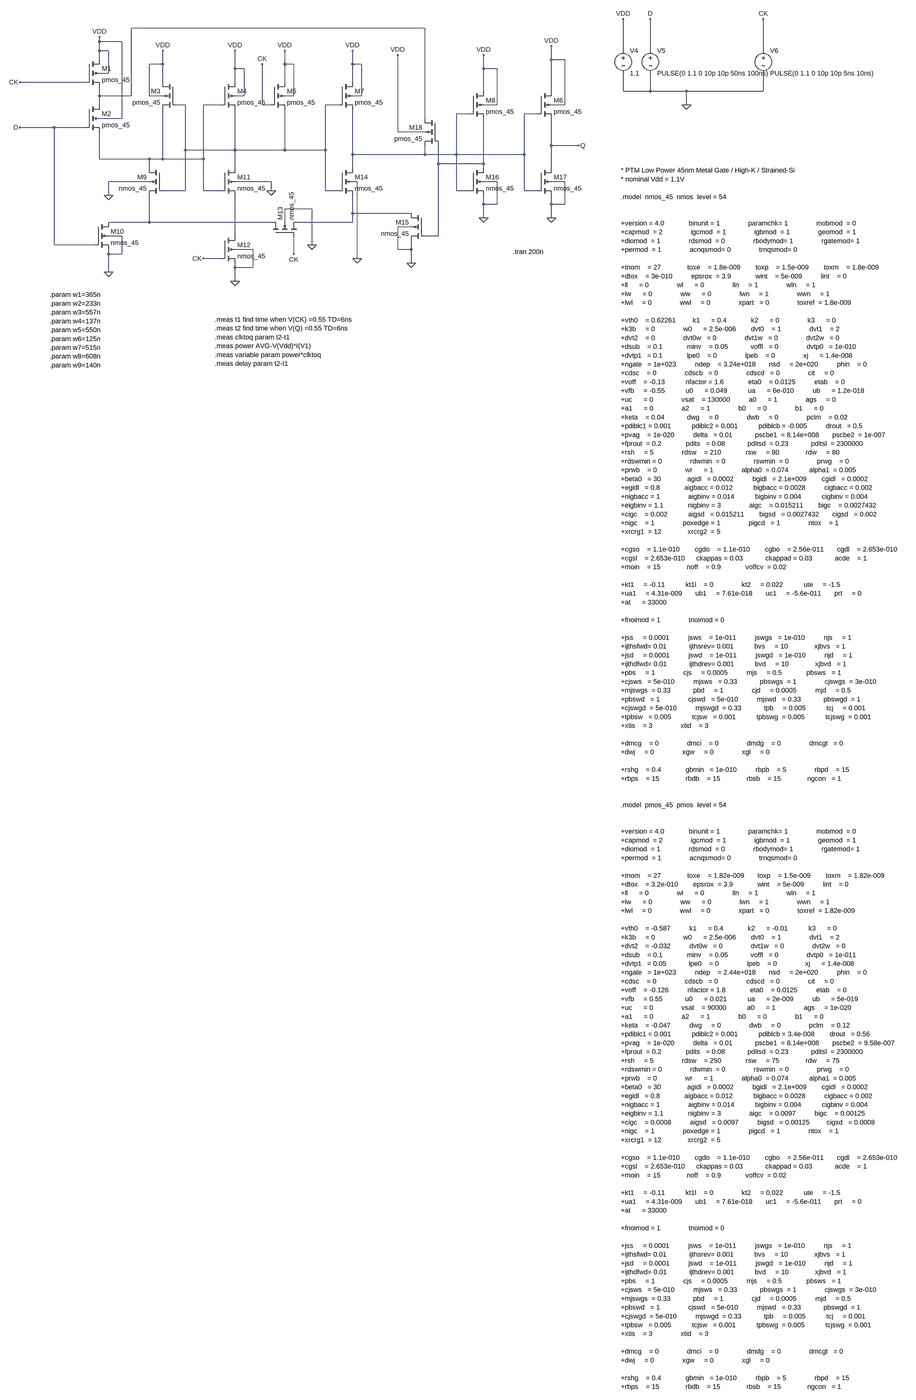
[diagram p0: schematic SPC-18T.asc, whole sheet]
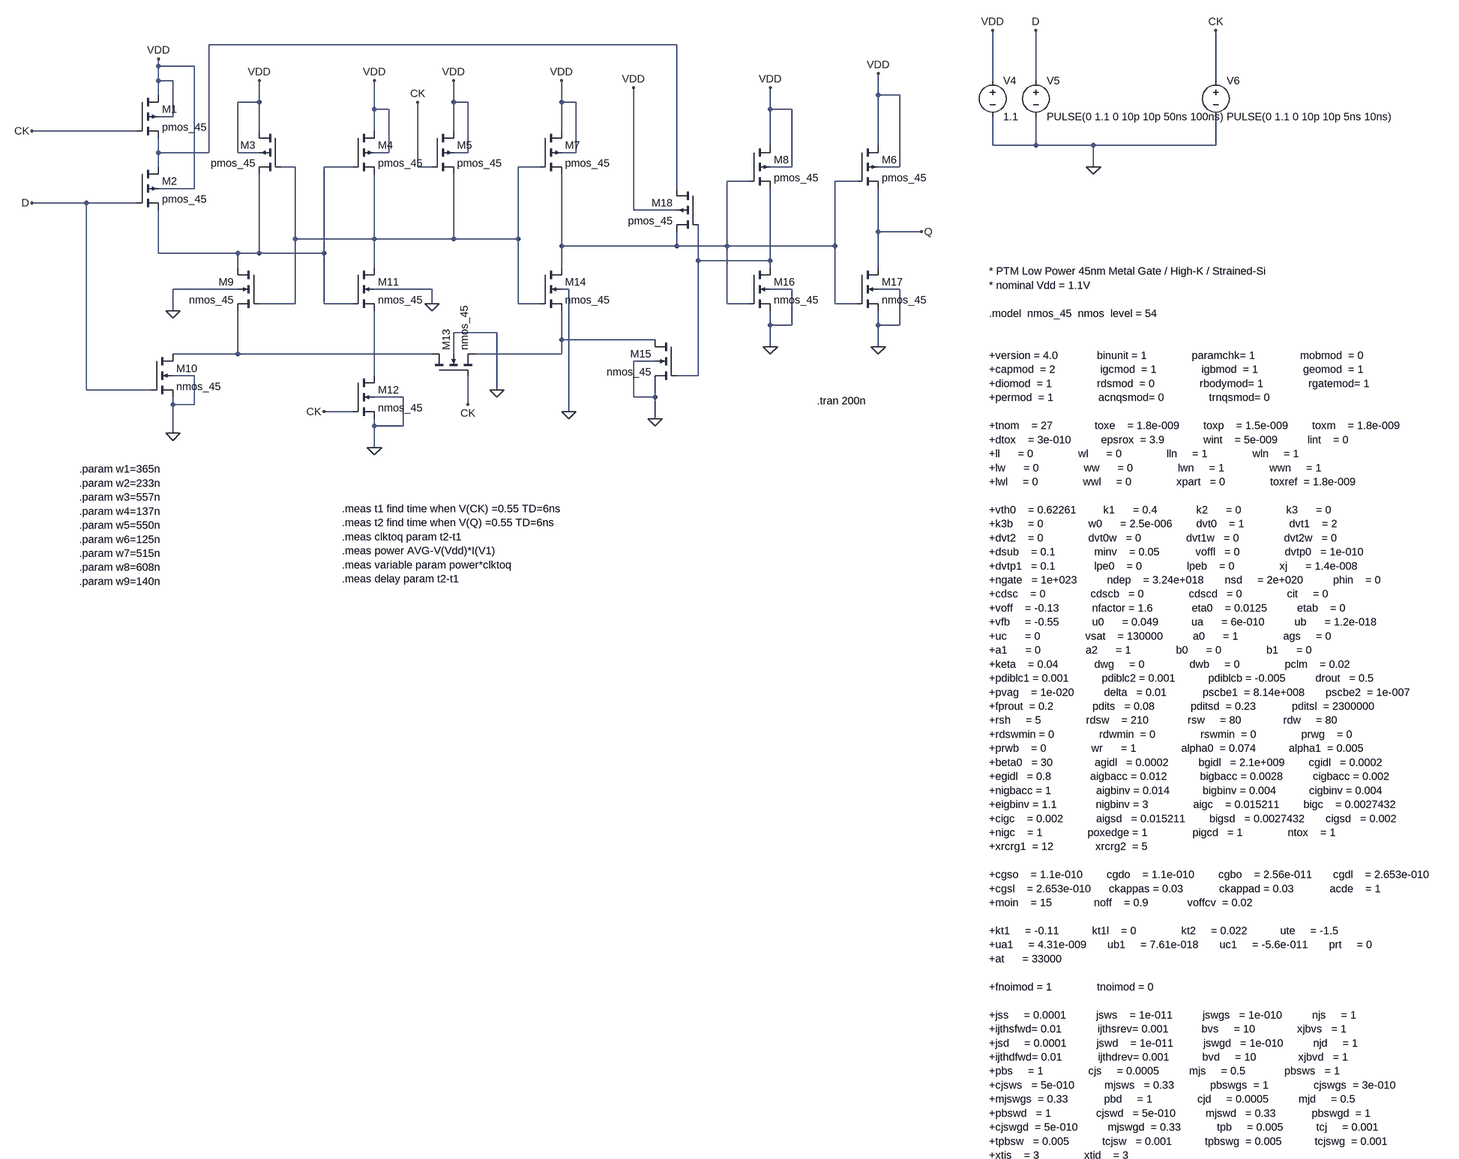
[diagram p1: schematic SPC-18T.asc, part, row 1 of 2, column 1 of 1]
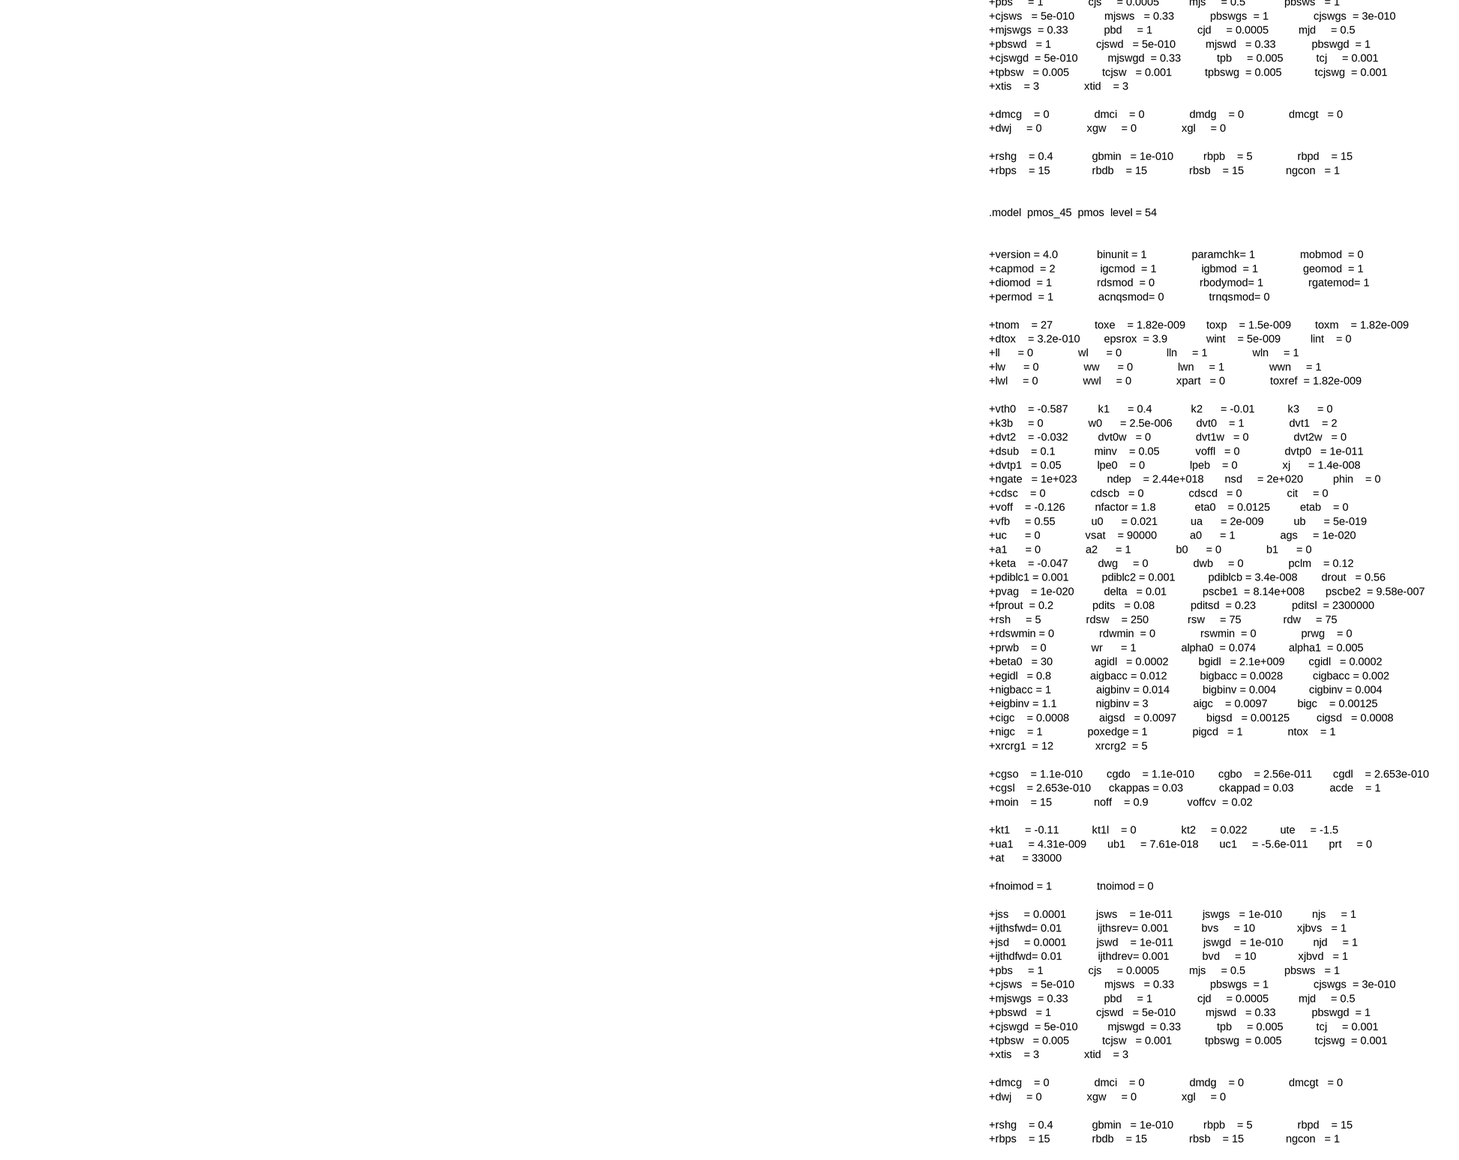
[diagram p2: schematic SPC-18T.asc, part, row 2 of 2, column 1 of 1]
SPC-18T.asc, the LTspice schematic file:
Version 4
SHEET 1 3776 4260
WIRE 912 -144 -128 -144
WIRE -240 -96 -240 -112
WIRE -160 -96 -240 -96
WIRE -240 -64 -240 -96
WIRE -208 -64 -240 -64
WIRE 1696 -64 1696 -176
WIRE 1792 -64 1792 -176
WIRE 2192 -64 2192 -176
WIRE -240 -32 -240 -64
WIRE 1360 -32 1360 -80
WIRE 1408 -32 1360 -32
WIRE -16 -16 -16 -64
WIRE -16 -16 -64 -16
WIRE 416 -16 416 -64
WIRE 448 -16 416 -16
WIRE 656 -16 656 -64
WIRE 688 -16 656 -16
WIRE 240 0 240 -64
WIRE 272 0 240 0
WIRE 1120 0 1120 -48
WIRE 1168 0 1120 0
WIRE -208 16 -208 -64
WIRE -208 16 -240 16
WIRE -288 48 -528 48
WIRE -16 48 -16 -16
WIRE 240 48 240 0
WIRE 416 48 416 -16
WIRE 656 48 656 -16
WIRE 1120 80 1120 0
WIRE 1360 80 1360 -32
WIRE 1696 80 1696 16
WIRE 1792 80 1792 16
WIRE 1792 80 1696 80
WIRE 1920 80 1792 80
WIRE 2192 80 2192 16
WIRE 2192 80 1920 80
WIRE -240 96 -240 64
WIRE -128 96 -128 -144
WIRE -128 96 -240 96
WIRE -64 96 -64 -16
WIRE -16 96 -64 96
WIRE 272 96 272 0
WIRE 272 96 240 96
WIRE 448 96 448 -16
WIRE 448 96 416 96
WIRE 688 96 688 -16
WIRE 688 96 656 96
WIRE -240 128 -240 96
WIRE 64 128 32 128
WIRE 192 128 128 128
WIRE 336 128 336 -16
WIRE 368 128 336 128
WIRE 608 128 560 128
WIRE 1168 128 1168 0
WIRE 1168 128 1120 128
WIRE 1408 128 1408 -32
WIRE 1408 128 1360 128
WIRE 1920 128 1920 80
WIRE 1072 160 1024 160
WIRE 1312 160 1264 160
WIRE -160 176 -160 -96
WIRE -160 176 -240 176
WIRE 912 176 912 -144
WIRE -400 208 -528 208
WIRE -288 208 -400 208
WIRE 816 224 816 -48
WIRE 912 224 816 224
WIRE 1360 272 1360 176
WIRE 1456 272 1360 272
WIRE 64 288 64 128
WIRE 240 288 240 144
WIRE 240 288 64 288
WIRE 416 288 416 144
WIRE 416 288 240 288
WIRE 560 288 560 128
WIRE 560 288 416 288
WIRE 656 304 656 144
WIRE 912 304 912 272
WIRE 912 304 656 304
WIRE 1024 304 1024 160
WIRE 1024 304 912 304
WIRE 1264 304 1264 160
WIRE 1264 304 1024 304
WIRE -240 320 -240 224
WIRE -64 320 -240 320
WIRE -16 320 -16 144
WIRE -16 320 -64 320
WIRE 128 320 128 128
WIRE 128 320 -16 320
WIRE 960 336 960 256
WIRE 1120 336 1120 176
WIRE 1120 336 960 336
WIRE -64 352 -64 320
WIRE 240 352 240 288
WIRE 656 352 656 304
WIRE 1120 352 1120 336
WIRE 1360 352 1360 272
WIRE -64 400 -208 400
WIRE 368 400 240 400
WIRE 672 400 656 400
WIRE 1168 400 1120 400
WIRE 1408 400 1360 400
WIRE 64 432 64 288
WIRE 64 432 -16 432
WIRE 128 432 128 320
WIRE 192 432 128 432
WIRE 368 432 368 400
WIRE 560 432 560 288
WIRE 608 432 560 432
WIRE 1024 432 1024 304
WIRE 1072 432 1024 432
WIRE 1264 432 1264 304
WIRE 1312 432 1264 432
WIRE -208 448 -208 400
WIRE 1120 480 1120 448
WIRE 1168 480 1168 400
WIRE 1168 480 1120 480
WIRE 1360 480 1360 448
WIRE 1408 480 1408 400
WIRE 1408 480 1360 480
WIRE 512 496 416 496
WIRE 656 512 656 448
WIRE 864 512 656 512
WIRE 1120 528 1120 480
WIRE 1360 528 1360 480
WIRE -64 544 -64 448
WIRE -64 544 -208 544
WIRE 368 544 -64 544
WIRE 416 544 416 496
WIRE 656 544 656 512
WIRE 656 544 464 544
WIRE 864 560 816 560
WIRE -160 592 -208 592
WIRE 240 592 240 448
WIRE 960 592 960 336
WIRE 960 592 912 592
WIRE -400 624 -400 208
WIRE -256 624 -400 624
WIRE 512 624 512 496
WIRE 304 640 240 640
WIRE 816 640 816 560
WIRE 864 640 864 608
WIRE 864 640 816 640
WIRE -208 656 -208 640
WIRE -160 656 -160 592
WIRE -160 656 -208 656
WIRE 448 656 448 592
WIRE 192 672 128 672
WIRE 672 672 672 400
WIRE 864 688 864 640
WIRE 240 704 240 688
WIRE 304 704 304 640
WIRE 304 704 240 704
WIRE -208 720 -208 656
WIRE 240 752 240 704
FLAG -208 720 0
FLAG 240 752 0
FLAG 512 624 0
FLAG 864 688 0
FLAG 1120 528 0
FLAG 1360 528 0
FLAG 672 672 0
FLAG -240 -112 VDD
FLAG -16 -64 VDD
FLAG 240 -64 VDD
FLAG 416 -64 VDD
FLAG 656 -64 VDD
FLAG 1120 -48 VDD
FLAG 1360 -80 VDD
FLAG -528 48 CK
FLAG 128 672 CK
FLAG 336 -16 CK
FLAG 448 656 CK
FLAG -528 208 D
FLAG 1456 272 Q
FLAG -208 448 0
FLAG 368 432 0
FLAG 816 -48 VDD
FLAG 1792 -176 D
FLAG 2192 -176 CK
FLAG 1696 -176 VDD
FLAG 1920 128 0
SYMBOL pmos4 -288 -32 R0
SYMATTR InstName M1
SYMATTR Value pmos_45
SYMATTR Value2 l=45n w=180n
SYMBOL pmos4 -288 128 R0
SYMATTR InstName M2
SYMATTR Value pmos_45
SYMATTR Value2 l=45n w=180n
SYMBOL pmos4 32 48 M0
SYMATTR InstName M3
SYMATTR Value pmos_45
SYMATTR Value2 l=45n w=180n
SYMBOL pmos4 192 48 R0
SYMATTR InstName M4
SYMATTR Value pmos_45
SYMATTR Value2 l=45n w=180n
SYMBOL pmos4 368 48 R0
SYMATTR InstName M5
SYMATTR Value pmos_45
SYMATTR Value2 l=45n w=180n
SYMBOL pmos4 1312 80 R0
SYMATTR InstName M6
SYMATTR Value pmos_45
SYMATTR Value2 l=45n w=180n
SYMBOL pmos4 608 48 R0
SYMATTR InstName M7
SYMATTR Value pmos_45
SYMATTR Value2 l=45n w=180n
SYMBOL pmos4 1072 80 R0
SYMATTR InstName M8
SYMATTR Value pmos_45
SYMATTR Value2 l=45n w=180n
SYMBOL nmos4 -16 352 M0
SYMATTR InstName M9
SYMATTR Value nmos_45
SYMATTR Value2 l=45n w={w2}
SYMBOL nmos4 -256 544 R0
SYMATTR InstName M10
SYMATTR Value nmos_45
SYMATTR Value2 l=45n w={w1}
SYMBOL nmos4 192 352 R0
SYMATTR InstName M11
SYMATTR Value nmos_45
SYMATTR Value2 l=45n w={w3}
SYMBOL nmos4 192 592 R0
SYMATTR InstName M12
SYMATTR Value nmos_45
SYMATTR Value2 l=45n w={w4}
SYMBOL nmos4 368 592 R270
SYMATTR InstName M13
SYMATTR Value nmos_45
SYMATTR Value2 l=45n w={w5}
SYMBOL nmos4 608 352 R0
SYMATTR InstName M14
SYMATTR Value nmos_45
SYMATTR Value2 l=45n w={w6}
SYMBOL nmos4 912 512 M0
SYMATTR InstName M15
SYMATTR Value nmos_45
SYMATTR Value2 l=45n w={w7}
SYMBOL nmos4 1072 352 R0
SYMATTR InstName M16
SYMATTR Value nmos_45
SYMATTR Value2 l=45n w={w8}
SYMBOL nmos4 1312 352 R0
SYMATTR InstName M17
SYMATTR Value nmos_45
SYMATTR Value2 l=45n w={w9}
SYMBOL pmos4 960 176 M0
SYMATTR InstName M18
SYMATTR Value pmos_45
SYMATTR Value2 l=45n w=180n
SYMBOL voltage 1696 -80 R0
WINDOW 123 0 0 Left 0
WINDOW 39 0 0 Left 0
SYMATTR InstName V4
SYMATTR Value 1.1
SYMBOL voltage 1792 -80 R0
WINDOW 123 0 0 Left 0
WINDOW 39 0 0 Left 0
SYMATTR InstName V5
SYMATTR Value PULSE(0 1.1 0 10p 10p 50ns 100ns)
SYMBOL voltage 2192 -80 R0
WINDOW 123 0 0 Left 0
WINDOW 39 0 0 Left 0
SYMATTR InstName V6
SYMATTR Value PULSE(0 1.1 0 10p 10p 5ns 10ns)
TEXT 1688 360 Left 2 !* PTM Low Power 45nm Metal Gate / High-K / Strained-Si\n* nominal Vdd = 1.1V\n \n.model  nmos_45  nmos  level = 54\n \n \n+version = 4.0             binunit = 1               paramchk= 1               mobmod  = 0             \n+capmod  = 2               igcmod  = 1               igbmod  = 1               geomod  = 1             \n+diomod  = 1               rdsmod  = 0               rbodymod= 1               rgatemod= 1             \n+permod  = 1               acnqsmod= 0               trnqsmod= 0             \n \n+tnom    = 27              toxe    = 1.8e-009        toxp    = 1.5e-009        toxm    = 1.8e-009      \n+dtox    = 3e-010          epsrox  = 3.9             wint    = 5e-009          lint    = 0             \n+ll      = 0               wl      = 0               lln     = 1               wln     = 1             \n+lw      = 0               ww      = 0               lwn     = 1               wwn     = 1             \n+lwl     = 0               wwl     = 0               xpart   = 0               toxref  = 1.8e-009      \n \n+vth0    = 0.62261         k1      = 0.4             k2      = 0               k3      = 0             \n+k3b     = 0               w0      = 2.5e-006        dvt0    = 1               dvt1    = 2             \n+dvt2    = 0               dvt0w   = 0               dvt1w   = 0               dvt2w   = 0             \n+dsub    = 0.1             minv    = 0.05            voffl   = 0               dvtp0   = 1e-010        \n+dvtp1   = 0.1             lpe0    = 0               lpeb    = 0               xj      = 1.4e-008      \n+ngate   = 1e+023          ndep    = 3.24e+018       nsd     = 2e+020          phin    = 0             \n+cdsc    = 0               cdscb   = 0               cdscd   = 0               cit     = 0             \n+voff    = -0.13           nfactor = 1.6             eta0    = 0.0125          etab    = 0             \n+vfb     = -0.55           u0      = 0.049           ua      = 6e-010          ub      = 1.2e-018      \n+uc      = 0               vsat    = 130000          a0      = 1               ags     = 0             \n+a1      = 0               a2      = 1               b0      = 0               b1      = 0             \n+keta    = 0.04            dwg     = 0               dwb     = 0               pclm    = 0.02          \n+pdiblc1 = 0.001           pdiblc2 = 0.001           pdiblcb = -0.005          drout   = 0.5           \n+pvag    = 1e-020          delta   = 0.01            pscbe1  = 8.14e+008       pscbe2  = 1e-007        \n+fprout  = 0.2             pdits   = 0.08            pditsd  = 0.23            pditsl  = 2300000       \n+rsh     = 5               rdsw    = 210             rsw     = 80              rdw     = 80            \n+rdswmin = 0               rdwmin  = 0               rswmin  = 0               prwg    = 0             \n+prwb    = 0               wr      = 1               alpha0  = 0.074           alpha1  = 0.005         \n+beta0   = 30              agidl   = 0.0002          bgidl   = 2.1e+009        cgidl   = 0.0002        \n+egidl   = 0.8             aigbacc = 0.012           bigbacc = 0.0028          cigbacc = 0.002         \n+nigbacc = 1               aigbinv = 0.014           bigbinv = 0.004           cigbinv = 0.004         \n+eigbinv = 1.1             nigbinv = 3               aigc    = 0.015211        bigc    = 0.0027432     \n+cigc    = 0.002           aigsd   = 0.015211        bigsd   = 0.0027432       cigsd   = 0.002         \n+nigc    = 1               poxedge = 1               pigcd   = 1               ntox    = 1             \n+xrcrg1  = 12              xrcrg2  = 5             \n \n+cgso    = 1.1e-010        cgdo    = 1.1e-010        cgbo    = 2.56e-011       cgdl    = 2.653e-010    \n+cgsl    = 2.653e-010      ckappas = 0.03            ckappad = 0.03            acde    = 1             \n+moin    = 15              noff    = 0.9             voffcv  = 0.02          \n \n+kt1     = -0.11           kt1l    = 0               kt2     = 0.022           ute     = -1.5          \n+ua1     = 4.31e-009       ub1     = 7.61e-018       uc1     = -5.6e-011       prt     = 0             \n+at      = 33000         \n \n+fnoimod = 1               tnoimod = 0             \n \n+jss     = 0.0001          jsws    = 1e-011          jswgs   = 1e-010          njs     = 1             \n+ijthsfwd= 0.01            ijthsrev= 0.001           bvs     = 10              xjbvs   = 1             \n+jsd     = 0.0001          jswd    = 1e-011          jswgd   = 1e-010          njd     = 1             \n+ijthdfwd= 0.01            ijthdrev= 0.001           bvd     = 10              xjbvd   = 1             \n+pbs     = 1               cjs     = 0.0005          mjs     = 0.5             pbsws   = 1             \n+cjsws   = 5e-010          mjsws   = 0.33            pbswgs  = 1               cjswgs  = 3e-010        \n+mjswgs  = 0.33            pbd     = 1               cjd     = 0.0005          mjd     = 0.5           \n+pbswd   = 1               cjswd   = 5e-010          mjswd   = 0.33            pbswgd  = 1             \n+cjswgd  = 5e-010          mjswgd  = 0.33            tpb     = 0.005           tcj     = 0.001         \n+tpbsw   = 0.005           tcjsw   = 0.001           tpbswg  = 0.005           tcjswg  = 0.001         \n+xtis    = 3               xtid    = 3             \n \n+dmcg    = 0               dmci    = 0               dmdg    = 0               dmcgt   = 0             \n+dwj     = 0               xgw     = 0               xgl     = 0             \n \n+rshg    = 0.4             gbmin   = 1e-010          rbpb    = 5               rbpd    = 15            \n+rbps    = 15              rbdb    = 15              rbsb    = 15              ngcon   = 1             \n \n \n.model  pmos_45  pmos  level = 54\n \n \n+version = 4.0             binunit = 1               paramchk= 1               mobmod  = 0             \n+capmod  = 2               igcmod  = 1               igbmod  = 1               geomod  = 1             \n+diomod  = 1               rdsmod  = 0               rbodymod= 1               rgatemod= 1             \n+permod  = 1               acnqsmod= 0               trnqsmod= 0             \n \n+tnom    = 27              toxe    = 1.82e-009       toxp    = 1.5e-009        toxm    = 1.82e-009     \n+dtox    = 3.2e-010        epsrox  = 3.9             wint    = 5e-009          lint    = 0             \n+ll      = 0               wl      = 0               lln     = 1               wln     = 1             \n+lw      = 0               ww      = 0               lwn     = 1               wwn     = 1             \n+lwl     = 0               wwl     = 0               xpart   = 0               toxref  = 1.82e-009     \n \n+vth0    = -0.587          k1      = 0.4             k2      = -0.01           k3      = 0             \n+k3b     = 0               w0      = 2.5e-006        dvt0    = 1               dvt1    = 2             \n+dvt2    = -0.032          dvt0w   = 0               dvt1w   = 0               dvt2w   = 0             \n+dsub    = 0.1             minv    = 0.05            voffl   = 0               dvtp0   = 1e-011        \n+dvtp1   = 0.05            lpe0    = 0               lpeb    = 0               xj      = 1.4e-008      \n+ngate   = 1e+023          ndep    = 2.44e+018       nsd     = 2e+020          phin    = 0             \n+cdsc    = 0               cdscb   = 0               cdscd   = 0               cit     = 0             \n+voff    = -0.126          nfactor = 1.8             eta0    = 0.0125          etab    = 0             \n+vfb     = 0.55            u0      = 0.021           ua      = 2e-009          ub      = 5e-019        \n+uc      = 0               vsat    = 90000           a0      = 1               ags     = 1e-020        \n+a1      = 0               a2      = 1               b0      = 0               b1      = 0             \n+keta    = -0.047          dwg     = 0               dwb     = 0               pclm    = 0.12          \n+pdiblc1 = 0.001           pdiblc2 = 0.001           pdiblcb = 3.4e-008        drout   = 0.56          \n+pvag    = 1e-020          delta   = 0.01            pscbe1  = 8.14e+008       pscbe2  = 9.58e-007     \n+fprout  = 0.2             pdits   = 0.08            pditsd  = 0.23            pditsl  = 2300000       \n+rsh     = 5               rdsw    = 250             rsw     = 75              rdw     = 75            \n+rdswmin = 0               rdwmin  = 0               rswmin  = 0               prwg    = 0             \n+prwb    = 0               wr      = 1               alpha0  = 0.074           alpha1  = 0.005         \n+beta0   = 30              agidl   = 0.0002          bgidl   = 2.1e+009        cgidl   = 0.0002        \n+egidl   = 0.8             aigbacc = 0.012           bigbacc = 0.0028          cigbacc = 0.002         \n+nigbacc = 1               aigbinv = 0.014           bigbinv = 0.004           cigbinv = 0.004         \n+eigbinv = 1.1             nigbinv = 3               aigc    = 0.0097          bigc    = 0.00125       \n+cigc    = 0.0008          aigsd   = 0.0097          bigsd   = 0.00125         cigsd   = 0.0008        \n+nigc    = 1               poxedge = 1               pigcd   = 1               ntox    = 1             \n+xrcrg1  = 12              xrcrg2  = 5             \n \n+cgso    = 1.1e-010        cgdo    = 1.1e-010        cgbo    = 2.56e-011       cgdl    = 2.653e-010    \n+cgsl    = 2.653e-010      ckappas = 0.03            ckappad = 0.03            acde    = 1             \n+moin    = 15              noff    = 0.9             voffcv  = 0.02          \n \n+kt1     = -0.11           kt1l    = 0               kt2     = 0.022           ute     = -1.5          \n+ua1     = 4.31e-009       ub1     = 7.61e-018       uc1     = -5.6e-011       prt     = 0             \n+at      = 33000         \n \n+fnoimod = 1               tnoimod = 0             \n \n+jss     = 0.0001          jsws    = 1e-011          jswgs   = 1e-010          njs     = 1             \n+ijthsfwd= 0.01            ijthsrev= 0.001           bvs     = 10              xjbvs   = 1             \n+jsd     = 0.0001          jswd    = 1e-011          jswgd   = 1e-010          njd     = 1             \n+ijthdfwd= 0.01            ijthdrev= 0.001           bvd     = 10              xjbvd   = 1             \n+pbs     = 1               cjs     = 0.0005          mjs     = 0.5             pbsws   = 1             \n+cjsws   = 5e-010          mjsws   = 0.33            pbswgs  = 1               cjswgs  = 3e-010        \n+mjswgs  = 0.33            pbd     = 1               cjd     = 0.0005          mjd     = 0.5           \n+pbswd   = 1               cjswd   = 5e-010          mjswd   = 0.33            pbswgd  = 1             \n+cjswgd  = 5e-010          mjswgd  = 0.33            tpb     = 0.005           tcj     = 0.001         \n+tpbsw   = 0.005           tcjsw   = 0.001           tpbswg  = 0.005           tcjswg  = 0.001         \n+xtis    = 3               xtid    = 3             \n \n+dmcg    = 0               dmci    = 0               dmdg    = 0               dmcgt   = 0             \n+dwj     = 0               xgw     = 0               xgl     = 0             \n \n+rshg    = 0.4             gbmin   = 1e-010          rbpb    = 5               rbpd    = 15            \n+rbps    = 15              rbdb    = 15              rbsb    = 15              ngcon   = 1
TEXT 1224 648 Left 2 !.tran 200n
TEXT -416 800 Left 2 !.param w1=365n \n.param w2=233n\n.param w3=557n\n.param w4=137n\n.param w5=550n\n.param w6=125n\n.param w7=515n\n.param w8=608n\n.param w9=140n
TEXT 168 888 Left 2 !.meas t1 find time when V(CK) =0.55 TD=6ns\n.meas t2 find time when V(Q) =0.55 TD=6ns\n.meas clktoq param t2-t1\n.meas power AVG-V(Vdd)*I(V1)\n.meas variable param power*clktoq\n.meas delay param t2-t1

The netlist it stands for:
* SPC-18T.asc
M1 VDD CK N001 VDD pmos_45 l=45n w=180n
M2 N001 D N003 VDD pmos_45 l=45n w=180n
M3 VDD N002 N003 VDD pmos_45 l=45n w=180n
M4 VDD N003 N002 VDD pmos_45 l=45n w=180n
M5 VDD CK N002 VDD pmos_45 l=45n w=180n
M6 VDD N004 Q VDD pmos_45 l=45n w=180n
M7 VDD N002 N004 VDD pmos_45 l=45n w=180n
M8 VDD N004 N005 VDD pmos_45 l=45n w=180n
M9 N003 N002 N007 0 nmos_45 l=45n w={w2}
M10 N007 D 0 0 nmos_45 l=45n w={w1}
M11 N002 N003 N008 0 nmos_45 l=45n w={w3}
M12 N008 CK 0 0 nmos_45 l=45n w={w4}
M13 N007 CK N006 0 nmos_45 l=45n w={w5}
M14 N004 N002 N006 0 nmos_45 l=45n w={w6}
M15 N006 N005 0 0 nmos_45 l=45n w={w7}
M16 N005 N004 0 0 nmos_45 l=45n w={w8}
M17 Q N004 0 0 nmos_45 l=45n w={w9}
M18 N001 N005 N004 VDD pmos_45 l=45n w=180n
V4 VDD 0 1.1
V5 D 0 PULSE(0 1.1 0 10p 10p 50ns 100ns)
V6 CK 0 PULSE(0 1.1 0 10p 10p 5ns 10ns)
.model NMOS NMOS
.model PMOS PMOS
.lib standard.mos
* PTM Low Power 45nm Metal Gate / High-K / Strained-Si
* nominal Vdd = 1.1V
.model  nmos_45  nmos  level = 54
+version = 4.0             binunit = 1               paramchk= 1               mobmod  = 0
+capmod  = 2               igcmod  = 1               igbmod  = 1               geomod  = 1
+diomod  = 1               rdsmod  = 0               rbodymod= 1               rgatemod= 1
+permod  = 1               acnqsmod= 0               trnqsmod= 0
+tnom    = 27              toxe    = 1.8e-009        toxp    = 1.5e-009        toxm    = 1.8e-009
+dtox    = 3e-010          epsrox  = 3.9             wint    = 5e-009          lint    = 0
+ll      = 0               wl      = 0               lln     = 1               wln     = 1
+lw      = 0               ww      = 0               lwn     = 1               wwn     = 1
+lwl     = 0               wwl     = 0               xpart   = 0               toxref  = 1.8e-009
+vth0    = 0.62261         k1      = 0.4             k2      = 0               k3      = 0
+k3b     = 0               w0      = 2.5e-006        dvt0    = 1               dvt1    = 2
+dvt2    = 0               dvt0w   = 0               dvt1w   = 0               dvt2w   = 0
+dsub    = 0.1             minv    = 0.05            voffl   = 0               dvtp0   = 1e-010
+dvtp1   = 0.1             lpe0    = 0               lpeb    = 0               xj      = 1.4e-008
+ngate   = 1e+023          ndep    = 3.24e+018       nsd     = 2e+020          phin    = 0
+cdsc    = 0               cdscb   = 0               cdscd   = 0               cit     = 0
+voff    = -0.13           nfactor = 1.6             eta0    = 0.0125          etab    = 0
+vfb     = -0.55           u0      = 0.049           ua      = 6e-010          ub      = 1.2e-018
+uc      = 0               vsat    = 130000          a0      = 1               ags     = 0
+a1      = 0               a2      = 1               b0      = 0               b1      = 0
+keta    = 0.04            dwg     = 0               dwb     = 0               pclm    = 0.02
+pdiblc1 = 0.001           pdiblc2 = 0.001           pdiblcb = -0.005          drout   = 0.5
+pvag    = 1e-020          delta   = 0.01            pscbe1  = 8.14e+008       pscbe2  = 1e-007
+fprout  = 0.2             pdits   = 0.08            pditsd  = 0.23            pditsl  = 2300000
+rsh     = 5               rdsw    = 210             rsw     = 80              rdw     = 80
+rdswmin = 0               rdwmin  = 0               rswmin  = 0               prwg    = 0
+prwb    = 0               wr      = 1               alpha0  = 0.074           alpha1  = 0.005
+beta0   = 30              agidl   = 0.0002          bgidl   = 2.1e+009        cgidl   = 0.0002
+egidl   = 0.8             aigbacc = 0.012           bigbacc = 0.0028          cigbacc = 0.002
+nigbacc = 1               aigbinv = 0.014           bigbinv = 0.004           cigbinv = 0.004
+eigbinv = 1.1             nigbinv = 3               aigc    = 0.015211        bigc    = 0.0027432
+cigc    = 0.002           aigsd   = 0.015211        bigsd   = 0.0027432       cigsd   = 0.002
+nigc    = 1               poxedge = 1               pigcd   = 1               ntox    = 1
+xrcrg1  = 12              xrcrg2  = 5
+cgso    = 1.1e-010        cgdo    = 1.1e-010        cgbo    = 2.56e-011       cgdl    = 2.653e-010
+cgsl    = 2.653e-010      ckappas = 0.03            ckappad = 0.03            acde    = 1
+moin    = 15              noff    = 0.9             voffcv  = 0.02
+kt1     = -0.11           kt1l    = 0               kt2     = 0.022           ute     = -1.5
+ua1     = 4.31e-009       ub1     = 7.61e-018       uc1     = -5.6e-011       prt     = 0
+at      = 33000
+fnoimod = 1               tnoimod = 0
+jss     = 0.0001          jsws    = 1e-011          jswgs   = 1e-010          njs     = 1
+ijthsfwd= 0.01            ijthsrev= 0.001           bvs     = 10              xjbvs   = 1
+jsd     = 0.0001          jswd    = 1e-011          jswgd   = 1e-010          njd     = 1
+ijthdfwd= 0.01            ijthdrev= 0.001           bvd     = 10              xjbvd   = 1
+pbs     = 1               cjs     = 0.0005          mjs     = 0.5             pbsws   = 1
+cjsws   = 5e-010          mjsws   = 0.33            pbswgs  = 1               cjswgs  = 3e-010
+mjswgs  = 0.33            pbd     = 1               cjd     = 0.0005          mjd     = 0.5
+pbswd   = 1               cjswd   = 5e-010          mjswd   = 0.33            pbswgd  = 1
+cjswgd  = 5e-010          mjswgd  = 0.33            tpb     = 0.005           tcj     = 0.001
+tpbsw   = 0.005           tcjsw   = 0.001           tpbswg  = 0.005           tcjswg  = 0.001
+xtis    = 3               xtid    = 3
+dmcg    = 0               dmci    = 0               dmdg    = 0               dmcgt   = 0
+dwj     = 0               xgw     = 0               xgl     = 0
+rshg    = 0.4             gbmin   = 1e-010          rbpb    = 5               rbpd    = 15
+rbps    = 15              rbdb    = 15              rbsb    = 15              ngcon   = 1
.model  pmos_45  pmos  level = 54
+version = 4.0             binunit = 1               paramchk= 1               mobmod  = 0
+capmod  = 2               igcmod  = 1               igbmod  = 1               geomod  = 1
+diomod  = 1               rdsmod  = 0               rbodymod= 1               rgatemod= 1
+permod  = 1               acnqsmod= 0               trnqsmod= 0
+tnom    = 27              toxe    = 1.82e-009       toxp    = 1.5e-009        toxm    = 1.82e-009
+dtox    = 3.2e-010        epsrox  = 3.9             wint    = 5e-009          lint    = 0
+ll      = 0               wl      = 0               lln     = 1               wln     = 1
+lw      = 0               ww      = 0               lwn     = 1               wwn     = 1
+lwl     = 0               wwl     = 0               xpart   = 0               toxref  = 1.82e-009
+vth0    = -0.587          k1      = 0.4             k2      = -0.01           k3      = 0
+k3b     = 0               w0      = 2.5e-006        dvt0    = 1               dvt1    = 2
+dvt2    = -0.032          dvt0w   = 0               dvt1w   = 0               dvt2w   = 0
+dsub    = 0.1             minv    = 0.05            voffl   = 0               dvtp0   = 1e-011
+dvtp1   = 0.05            lpe0    = 0               lpeb    = 0               xj      = 1.4e-008
+ngate   = 1e+023          ndep    = 2.44e+018       nsd     = 2e+020          phin    = 0
+cdsc    = 0               cdscb   = 0               cdscd   = 0               cit     = 0
+voff    = -0.126          nfactor = 1.8             eta0    = 0.0125          etab    = 0
+vfb     = 0.55            u0      = 0.021           ua      = 2e-009          ub      = 5e-019
+uc      = 0               vsat    = 90000           a0      = 1               ags     = 1e-020
+a1      = 0               a2      = 1               b0      = 0               b1      = 0
+keta    = -0.047          dwg     = 0               dwb     = 0               pclm    = 0.12
+pdiblc1 = 0.001           pdiblc2 = 0.001           pdiblcb = 3.4e-008        drout   = 0.56
+pvag    = 1e-020          delta   = 0.01            pscbe1  = 8.14e+008       pscbe2  = 9.58e-007
+fprout  = 0.2             pdits   = 0.08            pditsd  = 0.23            pditsl  = 2300000
+rsh     = 5               rdsw    = 250             rsw     = 75              rdw     = 75
+rdswmin = 0               rdwmin  = 0               rswmin  = 0               prwg    = 0
+prwb    = 0               wr      = 1               alpha0  = 0.074           alpha1  = 0.005
+beta0   = 30              agidl   = 0.0002          bgidl   = 2.1e+009        cgidl   = 0.0002
+egidl   = 0.8             aigbacc = 0.012           bigbacc = 0.0028          cigbacc = 0.002
+nigbacc = 1               aigbinv = 0.014           bigbinv = 0.004           cigbinv = 0.004
+eigbinv = 1.1             nigbinv = 3               aigc    = 0.0097          bigc    = 0.00125
+cigc    = 0.0008          aigsd   = 0.0097          bigsd   = 0.00125         cigsd   = 0.0008
+nigc    = 1               poxedge = 1               pigcd   = 1               ntox    = 1
+xrcrg1  = 12              xrcrg2  = 5
+cgso    = 1.1e-010        cgdo    = 1.1e-010        cgbo    = 2.56e-011       cgdl    = 2.653e-010
+cgsl    = 2.653e-010      ckappas = 0.03            ckappad = 0.03            acde    = 1
+moin    = 15              noff    = 0.9             voffcv  = 0.02
+kt1     = -0.11           kt1l    = 0               kt2     = 0.022           ute     = -1.5
+ua1     = 4.31e-009       ub1     = 7.61e-018       uc1     = -5.6e-011       prt     = 0
+at      = 33000
+fnoimod = 1               tnoimod = 0
+jss     = 0.0001          jsws    = 1e-011          jswgs   = 1e-010          njs     = 1
+ijthsfwd= 0.01            ijthsrev= 0.001           bvs     = 10              xjbvs   = 1
+jsd     = 0.0001          jswd    = 1e-011          jswgd   = 1e-010          njd     = 1
+ijthdfwd= 0.01            ijthdrev= 0.001           bvd     = 10              xjbvd   = 1
+pbs     = 1               cjs     = 0.0005          mjs     = 0.5             pbsws   = 1
+cjsws   = 5e-010          mjsws   = 0.33            pbswgs  = 1               cjswgs  = 3e-010
+mjswgs  = 0.33            pbd     = 1               cjd     = 0.0005          mjd     = 0.5
+pbswd   = 1               cjswd   = 5e-010          mjswd   = 0.33            pbswgd  = 1
+cjswgd  = 5e-010          mjswgd  = 0.33            tpb     = 0.005           tcj     = 0.001
+tpbsw   = 0.005           tcjsw   = 0.001           tpbswg  = 0.005           tcjswg  = 0.001
+xtis    = 3               xtid    = 3
+dmcg    = 0               dmci    = 0               dmdg    = 0               dmcgt   = 0
+dwj     = 0               xgw     = 0               xgl     = 0
+rshg    = 0.4             gbmin   = 1e-010          rbpb    = 5               rbpd    = 15
+rbps    = 15              rbdb    = 15              rbsb    = 15              ngcon   = 1
.tran 200n
.param w1=365n
.param w2=233n
.param w3=557n
.param w4=137n
.param w5=550n
.param w6=125n
.param w7=515n
.param w8=608n
.param w9=140n
.meas t1 find time when V(CK) =0.55 TD=6ns
.meas t2 find time when V(Q) =0.55 TD=6ns
.meas clktoq param t2-t1
.meas power AVG-V(Vdd)*I(V1)
.meas variable param power*clktoq
.meas delay param t2-t1
.backanno
.end